# Altium schematic sheet Top_Level.SchDoc
size 297 x 209 mm; SheetNumber: 1; SheetTotal: 9
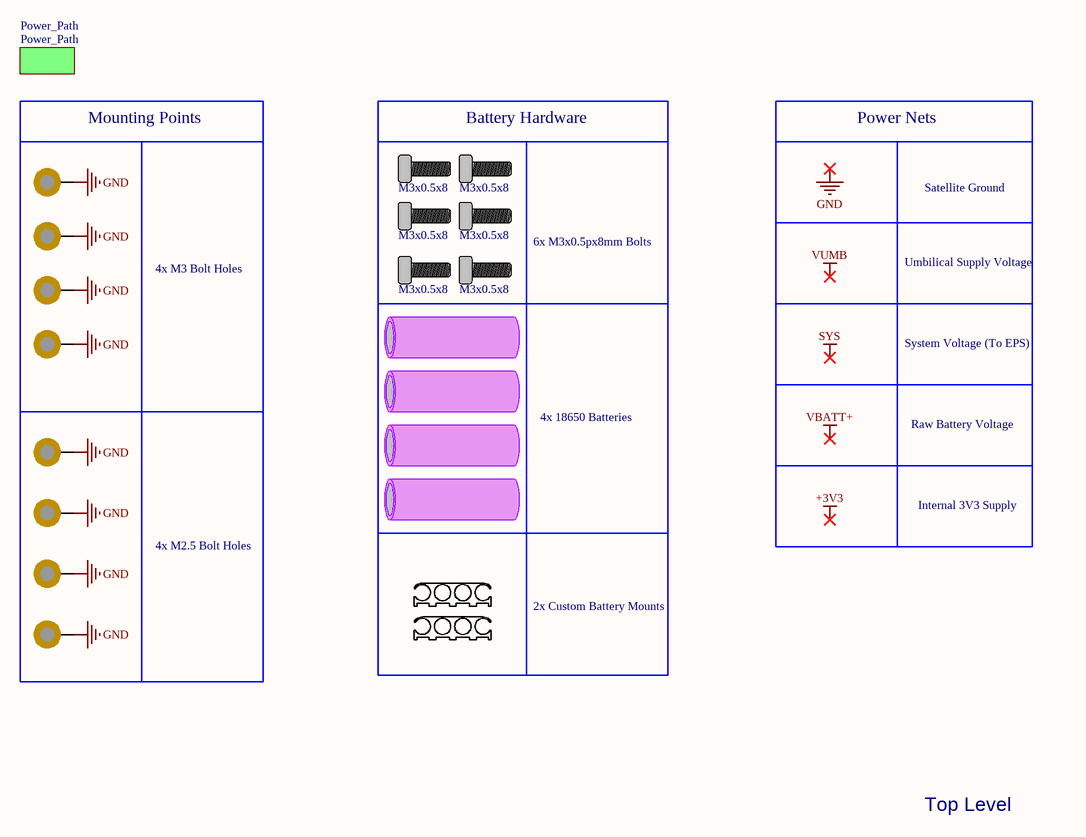
[diagram p0: Top_Level.SchDoc]

## Parts
BAT1  INR18650-35E  (value not drawn)  (mechanical)
BAT2  INR18650-35E  (value not drawn)  (mechanical)
BAT3  INR18650-35E  (value not drawn)  (mechanical)
BAT4  INR18650-35E  (value not drawn)  (mechanical)
MECH1  M3 Mounting Hole  [M3 Mounting Hole]  (value not drawn)  (no BOM)
MECH2  M3 Mounting Hole  [M3 Mounting Hole]  (value not drawn)  (no BOM)
MECH3  M3 Mounting Hole  [M3 Mounting Hole]  (value not drawn)  (no BOM)
MECH4  M3 Mounting Hole  [M3 Mounting Hole]  (value not drawn)  (no BOM)
MECH5  M3x0.5x8  [M3 x 0.50p x 8mm Bolt]
MECH6  M3x0.5x8  [M3 x 0.50p x 8mm Bolt]
MECH7  M3x0.5x8  [M3 x 0.50p x 8mm Bolt]
MECH8  M3x0.5x8  [M3 x 0.50p x 8mm Bolt]
MECH9  M3x0.5x8  [M3 x 0.50p x 8mm Bolt]
MECH10  M3x0.5x8  [M3 x 0.50p x 8mm Bolt]
MECH11  M2.5 Mounting Hole  [M2.5 Mounting Hole]  (value not drawn)
MECH12  M2.5 Mounting Hole  [M2.5 Mounting Hole]  (value not drawn)
MECH13  M2.5 Mounting Hole  [M2.5 Mounting Hole]  (value not drawn)
MECH14  M2.5 Mounting Hole  [M2.5 Mounting Hole]  (value not drawn)

## Blocks framed on the sheet
Mounting Points: MECH1-MECH4
Battery Hardware: BAT1-BAT4 MECH5-MECH10
4x M2.5 Bolt Holes: MECH11-MECH14

## Sub-sheets
Power_Path = Power_Path: no entries

## Nets
GND: MECH1.1 MECH2.1 MECH3.1 MECH4.1 MECH11.1 MECH12.1 MECH13.1 MECH14.1

## Notes on the sheet
- Power Nets
- Satellite Ground
- 6x M3x0.5px8mm Bolts
- Umbilical Supply Voltage
- 4x M3 Bolt Holes
- System Voltage (To EPS)
- 4x 18650 Batteries
- Raw Battery Voltage
- Internal 3V3 Supply
- 2x Custom Battery Mounts
- Top Level
- Labels drawn without touching a wire or pin: +3V3, GND, SYS, VBATT+, VUMB
- Size:
- Title:
- A4
- Project:
- Rev:
- Date:
- Drawn By:
- Sheet:
- of

## Library data of the parts
BAT1-BAT4 = INR18650-35E: Samsung 3500mAh 18650 Li-Ion battery; Continuous Current: 3.5A; Part Number: INR18650-35E; Distributor Part Number: SB2632; Distributor: Jaycar; Capacity: 3500mAh; Operating Temperature: 0°C to 50°C
MECH5-MECH10 = M3x0.5px8mm Bolt: M3 x 0.50p x 8mm Full Thread Metric Coarse Socket Head Cap Screw (2.5mm Key) A4-70 Stainless G316 DIN 912 / ISO 4762; Part Number: M3 x 0.50p x 8mm; Distributor: Bolt and Nut Australia; Distributor Part Number: M3 x 0.50p x 8mm